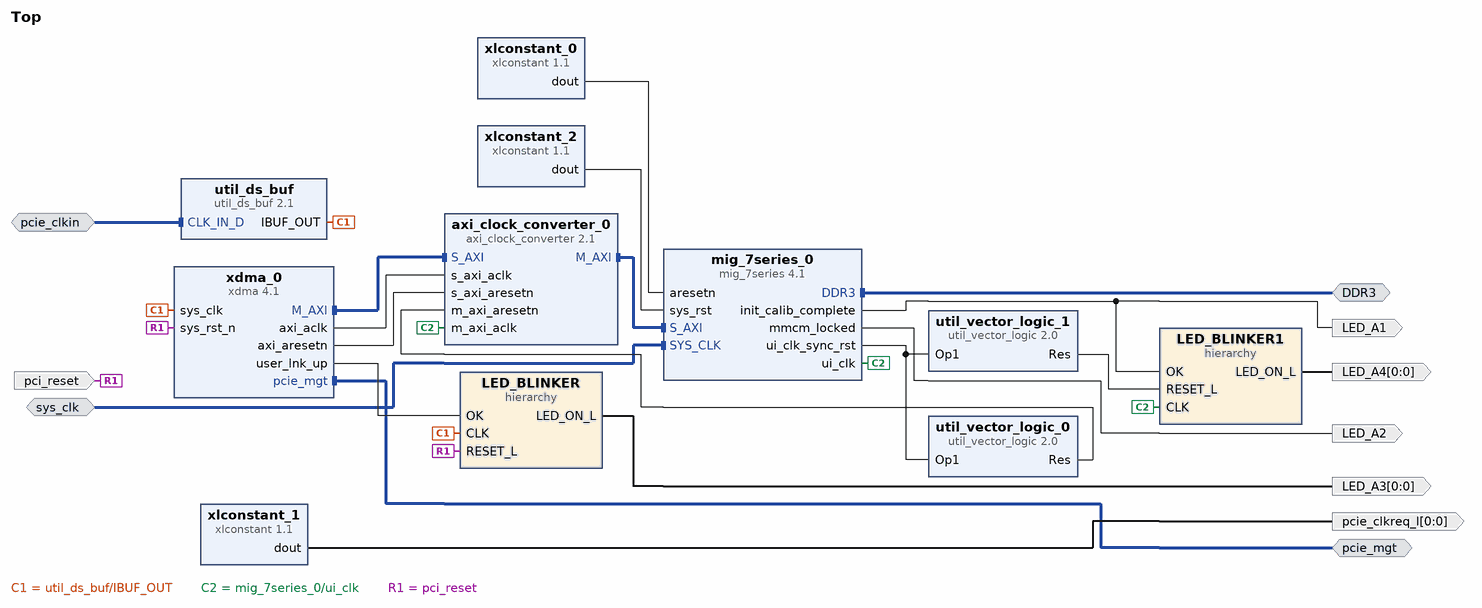
[diagram p0: block diagram of the top level]
# Vivado block design Top, xc7a200tfbg484-2, Vivado 2018.2
create_bd_design Top

create_bd_intf_port -mode Master -vlnv xilinx.com:interface:ddrx_rtl:1.0 DDR3
create_bd_intf_port -mode Master -vlnv xilinx.com:interface:pcie_7x_mgt_rtl:1.0 pcie_mgt
create_bd_intf_port -mode Slave -vlnv xilinx.com:interface:diff_clock_rtl:1.0 pcie_clkin
set_property -dict {CONFIG.FREQ_HZ 100000000} [get_bd_intf_ports pcie_clkin]
create_bd_intf_port -mode Slave -vlnv xilinx.com:interface:diff_clock_rtl:1.0 sys_clk
set_property -dict {CONFIG.FREQ_HZ 100000000} [get_bd_intf_ports sys_clk]
create_bd_port -dir O LED_A1
create_bd_port -dir O LED_A2
create_bd_port -dir O -from 0 -to 0 LED_A3
create_bd_port -dir I -type rst pci_reset
set_property -dict {CONFIG.POLARITY ACTIVE_LOW} [get_bd_ports pci_reset]
create_bd_port -dir O -from 0 -to 0 pcie_clkreq_l
create_bd_port -dir O -from 0 -to 0 LED_A4

create_bd_cell -type ip -vlnv xilinx.com:ip:mig_7series:4.1 mig_7series_0
set_property -dict [list \
  CONFIG.XML_INPUT_FILE mig_a.prj \
  CONFIG.RESET_BOARD_INTERFACE Custom \
  CONFIG.MIG_DONT_TOUCH_PARAM Custom \
  CONFIG.BOARD_MIG_PARAM Custom \
] [get_bd_cells mig_7series_0]
create_bd_cell -type hier LED_BLINKER
create_bd_cell -type hier LED_BLINKER1
create_bd_cell -type ip -vlnv xilinx.com:ip:util_vector_logic:2.0 util_vector_logic_0
set_property -dict {CONFIG.C_SIZE 1 CONFIG.C_OPERATION not} [get_bd_cells util_vector_logic_0]
create_bd_cell -type ip -vlnv xilinx.com:ip:util_vector_logic:2.0 util_vector_logic_1
set_property -dict {CONFIG.C_SIZE 1 CONFIG.C_OPERATION not} [get_bd_cells util_vector_logic_1]
create_bd_cell -type ip -vlnv xilinx.com:ip:axi_clock_converter:2.1 axi_clock_converter_0
set_property -dict {CONFIG.DATA_WIDTH 128} [get_bd_cells axi_clock_converter_0]
create_bd_cell -type ip -vlnv xilinx.com:ip:util_ds_buf:2.1 util_ds_buf
set_property -dict {CONFIG.C_BUF_TYPE IBUFDSGTE} [get_bd_cells util_ds_buf]
create_bd_cell -type ip -vlnv xilinx.com:ip:xdma:4.1 xdma_0
set_property -dict [list \
  CONFIG.pl_link_cap_max_link_width X4 \
  CONFIG.pl_link_cap_max_link_speed 5.0_GT/s \
  CONFIG.axi_data_width 128_bit \
  CONFIG.axisten_freq 125 \
  CONFIG.pf0_device_id 7024 \
  CONFIG.xdma_rnum_chnl 1 \
  CONFIG.xdma_wnum_chnl 1 \
  CONFIG.plltype QPLL1 \
  CONFIG.xdma_axi_intf_mm AXI_Memory_Mapped \
  CONFIG.cfg_mgmt_if false \
  CONFIG.PF0_DEVICE_ID_mqdma 9024 \
  CONFIG.PF2_DEVICE_ID_mqdma 9024 \
  CONFIG.PF3_DEVICE_ID_mqdma 9024 \
] [get_bd_cells xdma_0]
create_bd_cell -type ip -vlnv xilinx.com:ip:xlconstant:1.1 xlconstant_0
create_bd_cell -type ip -vlnv xilinx.com:ip:xlconstant:1.1 xlconstant_2
create_bd_cell -type ip -vlnv xilinx.com:ip:xlconstant:1.1 xlconstant_1
set_property -dict {CONFIG.CONST_VAL 0} [get_bd_cells xlconstant_1]

# ---- hierarchy /LED_BLINKER ----
current_bd_instance /LED_BLINKER
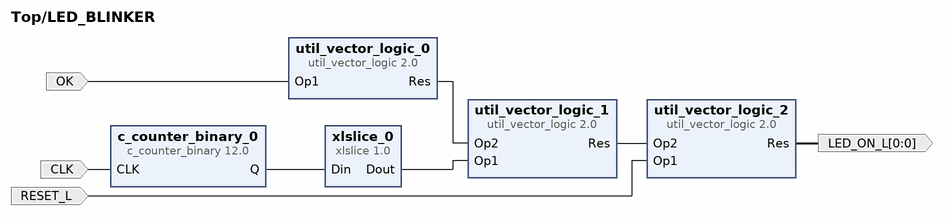
[diagram p1: block diagram inside /LED_BLINKER]
create_bd_pin -dir I CLK
create_bd_pin -dir I RESET_L
create_bd_pin -dir I OK
create_bd_pin -dir O -from 0 -to 0 LED_ON_L

create_bd_cell -type ip -vlnv xilinx.com:ip:c_counter_binary:12.0 c_counter_binary_0
set_property -dict {CONFIG.Output_Width 26} [get_bd_cells c_counter_binary_0]
create_bd_cell -type ip -vlnv xilinx.com:ip:xlslice:1.0 xlslice_0
set_property -dict {CONFIG.DIN_TO 25 CONFIG.DIN_FROM 25 CONFIG.DIN_WIDTH 26 CONFIG.DOUT_WIDTH 1} [get_bd_cells xlslice_0]
create_bd_cell -type ip -vlnv xilinx.com:ip:util_vector_logic:2.0 util_vector_logic_0
set_property -dict {CONFIG.C_SIZE 1 CONFIG.C_OPERATION not} [get_bd_cells util_vector_logic_0]
create_bd_cell -type ip -vlnv xilinx.com:ip:util_vector_logic:2.0 util_vector_logic_1
set_property -dict {CONFIG.C_SIZE 1 CONFIG.C_OPERATION or} [get_bd_cells util_vector_logic_1]
create_bd_cell -type ip -vlnv xilinx.com:ip:util_vector_logic:2.0 util_vector_logic_2
set_property -dict {CONFIG.C_SIZE 1 CONFIG.C_OPERATION and} [get_bd_cells util_vector_logic_2]

# ---- hierarchy /LED_BLINKER1 ----
current_bd_instance /LED_BLINKER1
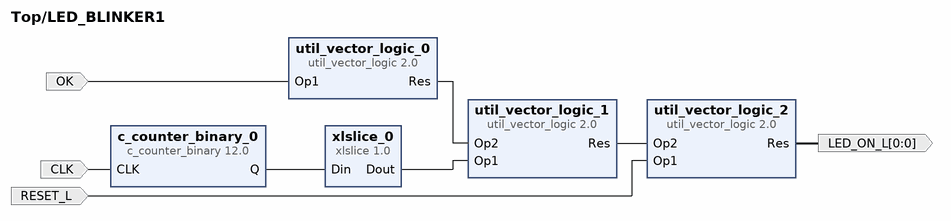
[diagram p2: block diagram inside /LED_BLINKER1]
create_bd_pin -dir I CLK
create_bd_pin -dir I RESET_L
create_bd_pin -dir I OK
create_bd_pin -dir O -from 0 -to 0 LED_ON_L

create_bd_cell -type ip -vlnv xilinx.com:ip:c_counter_binary:12.0 c_counter_binary_0
set_property -dict {CONFIG.Output_Width 26} [get_bd_cells c_counter_binary_0]
create_bd_cell -type ip -vlnv xilinx.com:ip:xlslice:1.0 xlslice_0
set_property -dict {CONFIG.DIN_TO 25 CONFIG.DIN_FROM 25 CONFIG.DIN_WIDTH 26 CONFIG.DOUT_WIDTH 1} [get_bd_cells xlslice_0]
create_bd_cell -type ip -vlnv xilinx.com:ip:util_vector_logic:2.0 util_vector_logic_0
set_property -dict {CONFIG.C_SIZE 1 CONFIG.C_OPERATION not} [get_bd_cells util_vector_logic_0]
create_bd_cell -type ip -vlnv xilinx.com:ip:util_vector_logic:2.0 util_vector_logic_1
set_property -dict {CONFIG.C_SIZE 1 CONFIG.C_OPERATION or} [get_bd_cells util_vector_logic_1]
create_bd_cell -type ip -vlnv xilinx.com:ip:util_vector_logic:2.0 util_vector_logic_2
set_property -dict {CONFIG.C_SIZE 1 CONFIG.C_OPERATION and} [get_bd_cells util_vector_logic_2]

# ---- connections ----

current_bd_instance /LED_BLINKER
connect_bd_net [get_bd_pins c_counter_binary_0/Q] [get_bd_pins xlslice_0/Din]
connect_bd_net [get_bd_pins CLK] [get_bd_pins c_counter_binary_0/CLK]
connect_bd_net [get_bd_pins OK] [get_bd_pins util_vector_logic_0/Op1]
connect_bd_net [get_bd_pins xlslice_0/Dout] [get_bd_pins util_vector_logic_1/Op1]
connect_bd_net [get_bd_pins util_vector_logic_0/Res] [get_bd_pins util_vector_logic_1/Op2]
connect_bd_net [get_bd_pins RESET_L] [get_bd_pins util_vector_logic_2/Op1]
connect_bd_net [get_bd_pins util_vector_logic_1/Res] [get_bd_pins util_vector_logic_2/Op2]
connect_bd_net [get_bd_pins util_vector_logic_2/Res] [get_bd_pins LED_ON_L]

current_bd_instance /LED_BLINKER1
connect_bd_net [get_bd_pins c_counter_binary_0/Q] [get_bd_pins xlslice_0/Din]
connect_bd_net [get_bd_pins CLK] [get_bd_pins c_counter_binary_0/CLK]
connect_bd_net [get_bd_pins OK] [get_bd_pins util_vector_logic_0/Op1]
connect_bd_net [get_bd_pins xlslice_0/Dout] [get_bd_pins util_vector_logic_1/Op1]
connect_bd_net [get_bd_pins util_vector_logic_0/Res] [get_bd_pins util_vector_logic_1/Op2]
connect_bd_net [get_bd_pins RESET_L] [get_bd_pins util_vector_logic_2/Op1]
connect_bd_net [get_bd_pins util_vector_logic_1/Res] [get_bd_pins util_vector_logic_2/Op2]
connect_bd_net [get_bd_pins util_vector_logic_2/Res] [get_bd_pins LED_ON_L]

current_bd_instance /
connect_bd_intf_net [get_bd_intf_pins axi_clock_converter_0/M_AXI] [get_bd_intf_pins mig_7series_0/S_AXI]
connect_bd_intf_net [get_bd_intf_pins axi_clock_converter_0/S_AXI] [get_bd_intf_pins xdma_0/M_AXI]
connect_bd_intf_net [get_bd_intf_ports DDR3] [get_bd_intf_pins mig_7series_0/DDR3]
connect_bd_intf_net [get_bd_intf_ports pcie_mgt] [get_bd_intf_pins xdma_0/pcie_mgt]
connect_bd_intf_net -intf_net diff_clock_rtl_0_1 [get_bd_intf_ports pcie_clkin] [get_bd_intf_pins util_ds_buf/CLK_IN_D]
connect_bd_intf_net -intf_net diff_clock_rtl_1_1 [get_bd_intf_ports sys_clk] [get_bd_intf_pins mig_7series_0/SYS_CLK]
connect_bd_net [get_bd_pins util_ds_buf/IBUF_OUT] [get_bd_pins xdma_0/sys_clk] [get_bd_pins LED_BLINKER/CLK]
connect_bd_net [get_bd_pins mig_7series_0/init_calib_complete] [get_bd_ports LED_A1] [get_bd_pins LED_BLINKER1/OK]
connect_bd_net [get_bd_pins mig_7series_0/mmcm_locked] [get_bd_ports LED_A2]
connect_bd_net -net OK_1 [get_bd_pins xdma_0/user_lnk_up] [get_bd_pins LED_BLINKER/OK]
connect_bd_net [get_bd_pins LED_BLINKER/LED_ON_L] [get_bd_ports LED_A3]
connect_bd_net [get_bd_pins mig_7series_0/ui_clk] [get_bd_pins axi_clock_converter_0/m_axi_aclk] [get_bd_pins LED_BLINKER1/CLK]
connect_bd_net [get_bd_ports pci_reset] [get_bd_pins xdma_0/sys_rst_n] [get_bd_pins LED_BLINKER/RESET_L]
connect_bd_net [get_bd_pins xlconstant_1/dout] [get_bd_ports pcie_clkreq_l]
connect_bd_net [get_bd_pins LED_BLINKER1/LED_ON_L] [get_bd_ports LED_A4]
connect_bd_net [get_bd_pins xdma_0/axi_aclk] [get_bd_pins axi_clock_converter_0/s_axi_aclk]
connect_bd_net [get_bd_pins xdma_0/axi_aresetn] [get_bd_pins axi_clock_converter_0/s_axi_aresetn]
connect_bd_net [get_bd_pins util_vector_logic_0/Res] [get_bd_pins axi_clock_converter_0/m_axi_aresetn]
connect_bd_net [get_bd_pins mig_7series_0/ui_clk_sync_rst] [get_bd_pins util_vector_logic_0/Op1] [get_bd_pins util_vector_logic_1/Op1]
connect_bd_net [get_bd_pins xlconstant_0/dout] [get_bd_pins mig_7series_0/aresetn]
connect_bd_net [get_bd_pins xlconstant_2/dout] [get_bd_pins mig_7series_0/sys_rst]
connect_bd_net -net RESET_L_1 [get_bd_pins util_vector_logic_1/Res] [get_bd_pins LED_BLINKER1/RESET_L]

# ---- address map ----
assign_bd_address -offset 0x0000000080000000 -range 512M -target_address_space [get_bd_addr_spaces xdma_0/M_AXI] [get_bd_addr_segs mig_7series_0/memmap/memaddr]

validate_bd_design
save_bd_design
